# EAGLE design BJ_GIRA_Taster4.4 (EAGLE 7.4.0)
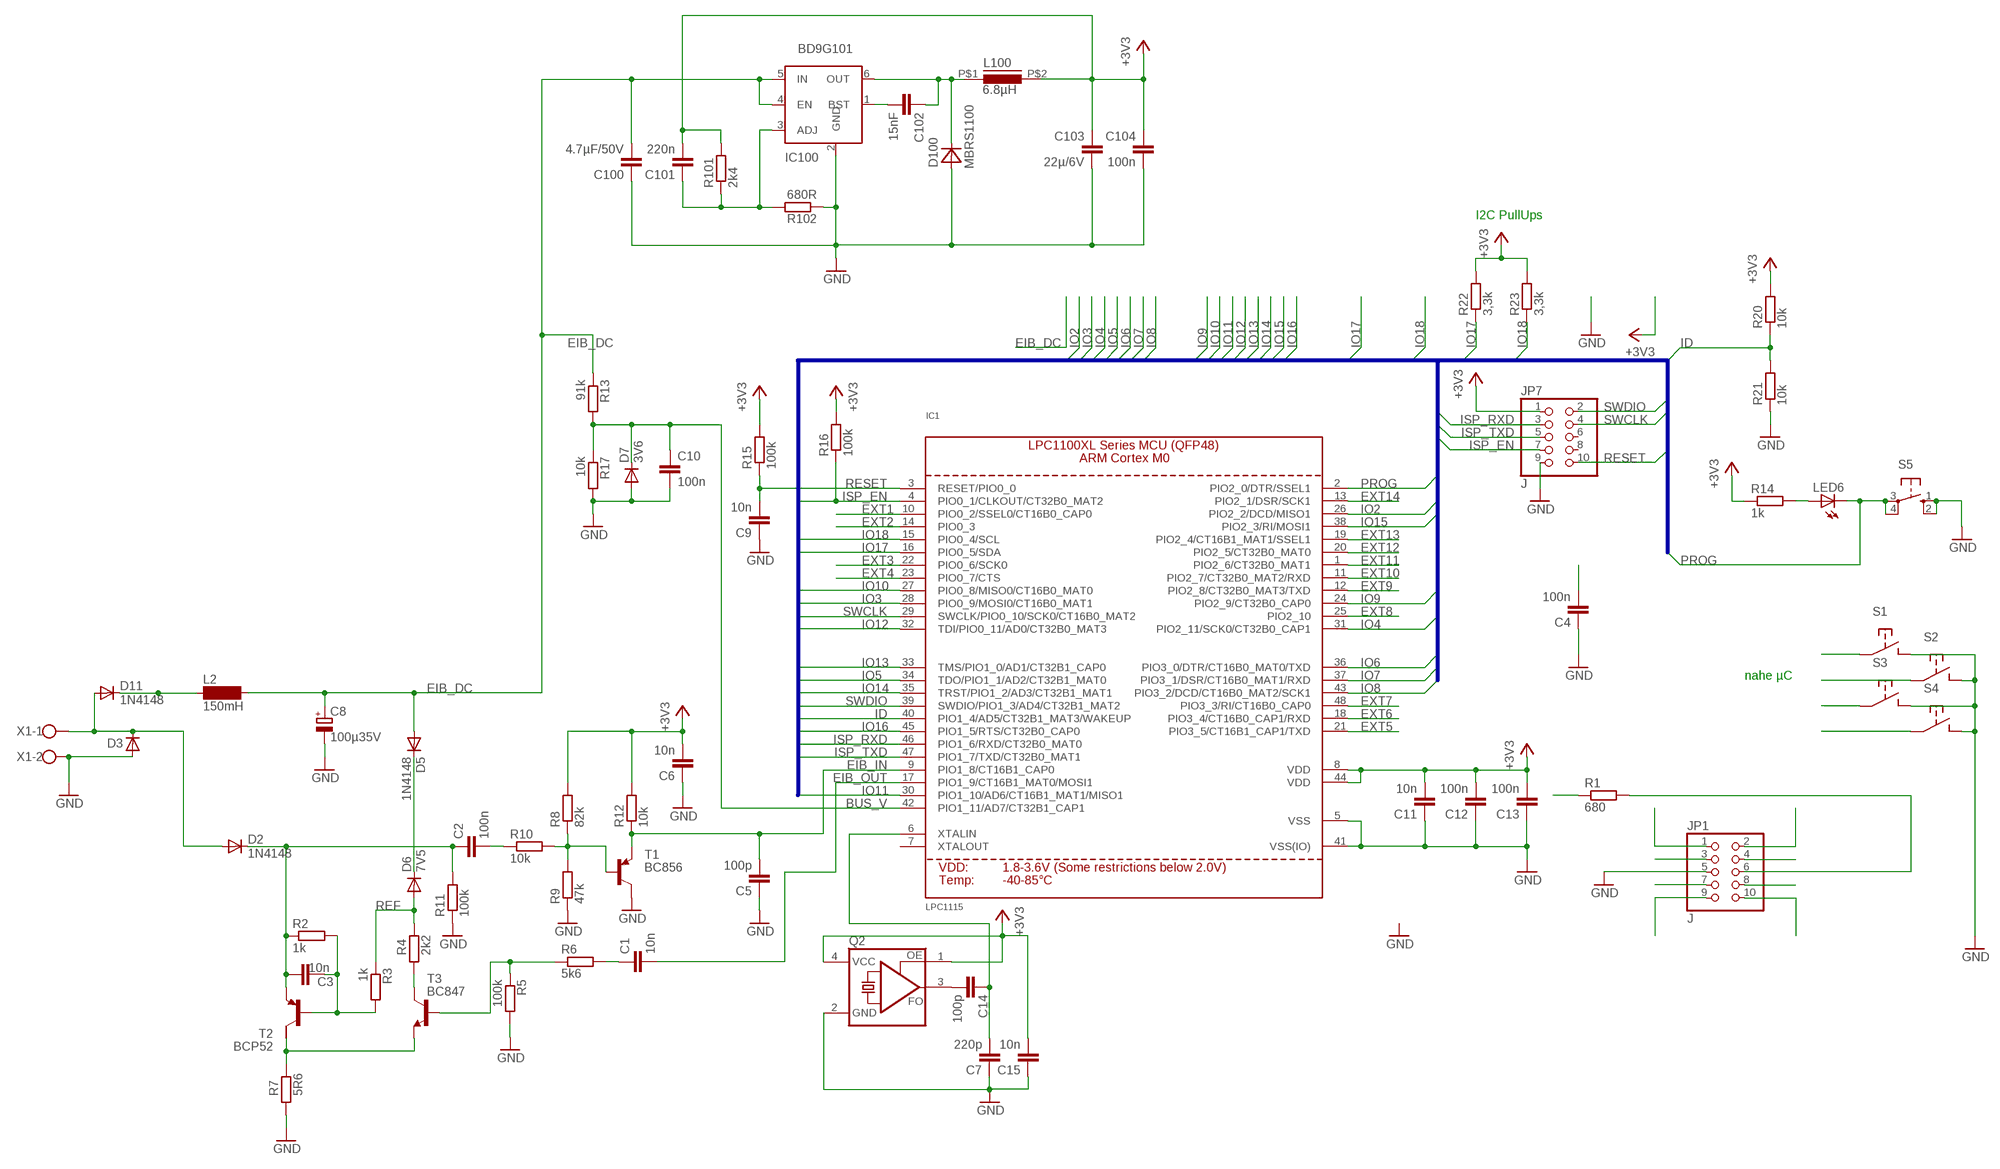
[diagram p0: schematic, sheet 1]

## Parts
C1  10n  C-EUC1206  [C1206]
C2  100n  C-EUC1206  [C1206]
C3  10n  C-EUC1206  [C1206]
C4  100n  C-EUC1206  [C1206]
C5  100p  C-EUC1206  [C1206]
C6  10n  C-EUC1206  [C1206]
C7  220p  C-EUC1206  [C1206]
C8  100µ35V  CPOL-EUE3.5-8  [E3,5-8]
C9  10n  C-EUC1206  [C1206]
C10  100n  C-EUC1206  [C1206]
C11  10n  C-EUC1206  [C1206]
C12  100n  C-EUC1206  [C1206]
C13  100n  C-EUC1206  [C1206]
C14  100p  C-EUC1206  [C1206]
C15  10n  C-EUC1206  [C1206]
C100  4.7µF/50V  C-EUC1206  [C1206]
C101  220n  C-EUC1206  [C1206]
C102  15nF  C-EUC1206  [C1206]
C103  22µ/6V  C-EUC1206  [C1206]
C104  100n  C-EUC1206  [C1206]
D2  1N4148  DIODE-MINIMELF  [MINIMELF]
D3  D-SMB  [SMB]
D5  1N4148  DIODE-MINIMELF  [MINIMELF]
D6  7V5  DIODE-MINIMELF  [MINIMELF]
D7  3V6  DIODE-MINIMELF  [MINIMELF]
D11  1N4148  DIODE-MINIMELF  [MINIMELF]
D100  MBRS1100  MBRA340T3  [SMA]
IC1  LPC1115  LPC1113/4/5_QFP48_XLSERIES  [LQFP48]
IC100  BD9G101  BD9G101GBD9G101G-SOT23-6  [SOT23-6]
JP1  J  PINHD-2X05_2.00  [2X05M]
JP7  J  PINHD-2X05_2.00  [2X05M]
L2  150mH  BS11  [BS11]
L100  6.8µH  IND_FASTRON_1616FPS  [PIS2812]
LED6  LED3MM  [LED3MM]
Q2  ASFL  [ASF]
R1  680  R-EU_R1206  [R1206]
R2  1k  R-EU_R1206  [R1206]
R3  1k  R-EU_R1206  [R1206]
R4  2k2  R-EU_R1206  [R1206]
R5  100k  R-EU_R1206  [R1206]
R6  5k6  R-EU_R1206  [R1206]
R7  5R6  R-EU_R1206  [R1206]
R8  82k  R-EU_R1206  [R1206]
R9  47k  R-EU_R1206  [R1206]
R10  10k  R-EU_R1206  [R1206]
R11  100k  R-EU_R1206  [R1206]
R12  10k  R-EU_R1206  [R1206]
R13  91k  R-EU_R1206  [R1206]
R14  1k  R-EU_R1206  [R1206]
R15  100k  R-EU_R1206  [R1206]
R16  100k  R-EU_R1206  [R1206]
R17  10k  R-EU_R1206  [R1206]
R20  10k  R-EU_R1206  [R1206]
R21  10k  R-EU_R1206  [R1206]
R22  3,3k  R-EU_R1206  [R1206]
R23  3,3k  R-EU_R1206  [R1206]
R101  2k4  R-EU_R1206  [R1206]
R102  680R  R-EU_R1206  [R1206]
S1  33053305A  [3305A]
S2  33053305A  [3305A]
S3  33053305A  [3305A]
S4  33053305A  [3305A]
S5  10-XX  [B3F-10XX]
T1  BC856  BC856BSMD  [SOT23-BEC]
T2  BCP52  FZT753SMD  [SOT223]
T3  BC847  [SOT23]
X1  W237-02P  [W237-132]

## Nets
+3V3: C6.2 C11.2 C12.2 C13.2 C15.2 C101.2 C103.1 C104.1 IC1.8(VDD) IC1.44(VDD) JP1.4 JP7.1 L100.P$2 Q2.1(OE) Q2.4(VCC) R8.2 R12.2 R14.1 R15.2 R16.2 R20.2 R22.2 R23.2 R101.2
BUS_V: C10.2 D7.C IC1.42(PIO1_11/AD7/CT32B1_CAP1) R13.2 R17.1
DRAIN: C2.1 C3.1 D2.C R2.1 R11.2 T2.3(E)
EIB+: D2.A D3.1(C) D11.A X1.1
EIB_DC: C8.+ C100.2 D5.A IC100.4(EN) IC100.5(IN) L2.2 R13.1
EIB_IN: C5.2 IC1.9(PIO1_8/CT16B1_CAP0) R12.1 T1.E
EIB_OUT: C1.2 IC1.17(PIO1_9/CT16B1_MAT0/MOSI1)
EXT1: IC1.10(PIO0_2/SSEL0/CT16B0_CAP0)
EXT2: IC1.14(PIO0_3)
EXT3: IC1.22(PIO0_6/SCK0)
EXT4: IC1.23(PIO0_7/CTS) S2.P$1
EXT5: IC1.21(PIO3_5/CT16B1_CAP1/TXD) JP1.7
EXT6: IC1.18(PIO3_4/CT16B0_CAP1/RXD) JP1.8
EXT7: IC1.48(PIO3_3/RI/CT16B0_CAP0) S1.P$1
EXT8: IC1.25(PIO2_10) S3.P$1
EXT9: IC1.12(PIO2_8/CT32B0_MAT3/TXD)
EXT10: IC1.11(PIO2_7/CT32B0_MAT2/RXD)
EXT11: IC1.1(PIO2_6/CT32B0_MAT1) JP1.10 R1.1
EXT12: IC1.20(PIO2_5/CT32B0_MAT0)
EXT13: IC1.19(PIO2_4/CT16B1_MAT1/SSEL1)
EXT14: IC1.13(PIO2_1/DSR/SCK1) JP1.1
GND: C4.1 C5.1 C6.1 C7.1 C8.- C9.1 C10.1 C11.1 C12.1 C13.1 C15.1 C100.1 C103.2 C104.2 D3.2(A) D7.A D100.A IC1.5(VSS) IC1.41(VSS(IO)) IC100.2(GND) JP1.5 JP7.9 Q2.2(GND) R5.2 R7.1 R9.1 R11.1 R17.2 R21.1 R102.1 S1.P$2 S2.P$2 S3.P$2 S4.P$2 S5.1(S) S5.2(S1) T1.C X1.2
ID: IC1.40(PIO1_4/AD5/CT32B1_MAT3/WAKEUP) R20.1 R21.2
IO2: IC1.26(PIO2_2/DCD/MISO1) JP1.2
IO3: IC1.28(PIO0_9/MOSI0/CT16B0_MAT1)
IO4: IC1.31(PIO2_11/SCK0/CT32B0_CAP1) JP1.3
IO5: IC1.34(TDO/PIO1_1/AD2/CT32B1_MAT0)
IO6: IC1.36(PIO3_0/DTR/CT16B0_MAT0/TXD)
IO7: IC1.37(PIO3_1/DSR/CT16B0_MAT1/RXD)
IO8: IC1.43(PIO3_2/DCD/CT16B0_MAT2/SCK1)
IO9: IC1.24(PIO2_9/CT32B0_CAP0) S4.P$1
IO10: IC1.27(PIO0_8/MISO0/CT16B0_MAT0)
IO11: IC1.30(PIO1_10/AD6/CT16B1_MAT1/MISO1)
IO12: IC1.32(TDI/PIO0_11/AD0/CT32B0_MAT3)
IO13: IC1.33(TMS/PIO1_0/AD1/CT32B1_CAP0)
IO14: IC1.35(TRST/PIO1_2/AD3/CT32B1_MAT1)
IO15: IC1.38(PIO2_3/RI/MOSI1) JP1.9
IO16: IC1.45(PIO1_5/RTS/CT32B0_CAP0)
IO17: IC1.16(PIO0_5/SDA) R22.1
IO18: IC1.15(PIO0_4/SCL) R23.1
ISP_EN: IC1.4(PIO0_1/CLKOUT/CT32B0_MAT2) JP7.7 R16.1
ISP_RXD: IC1.46(PIO1_6/RXD/CT32B0_MAT0) JP7.3
ISP_TXD: IC1.47(PIO1_7/TXD/CT32B0_MAT1) JP7.5
LX: C102.1 D100.C IC100.6(OUT) L100.P$1
N$1: C2.2 R10.1
N$2: C101.1 IC100.3(ADJ) R101.1 R102.2
N$7: R4.1 T3.3(C)
N$8: JP1.6 R1.2
N$9: LED6.A R14.2
N$10: C1.1 R6.2
N$11: C3.2 R2.2 R3.2 T2.1(B)
N$12: R5.1 R6.1 T3.1(B)
N$13: R7.2 T2.2(C) T3.2(E)
N$14: R8.1 R9.2 R10.2 T1.B
N$16: D5.C D6.C
N$17: C7.2 C14.1 IC1.6(XTALIN)
N$18: C14.2 Q2.3(FO)
N$19: C102.2 IC100.1(BST)
N$53: D11.C L2.1
PROG: IC1.2(PIO2_0/DTR/SSEL1) LED6.K(C) S5.3(P) S5.4(P1)
REF: D6.A R3.1 R4.2
RESET: C9.2 IC1.3(RESET/PIO0_0) JP7.10 R15.1
SWCLK: IC1.29(SWCLK/PIO0_10/SCK0/CT16B0_MAT2) JP7.4
SWDIO: IC1.39(SWDIO/PIO1_3/AD4/CT32B1_MAT2) JP7.2
VCC_LPC: C4.2
Unconnected: IC1.7(XTALOUT) JP7.6 JP7.8 T2.4(C/)

## Buses
IO[1..18],RESET,SWCLK,SWDIO,ISP_EN,PROG,ID,ISP_TXD,ISP_RXD

## Notes on the sheet
- I2C PullUps
- nahe µC

## Library data of the parts
C1 C3 C6 C9 C11 = rcl:C-EU: CAPACITOR, European symbol; REICHELT: X7R-G0805 10N
C2 C10 C12 C13 C104 = rcl:C-EU: CAPACITOR, European symbol; REICHELT: X7R-G0805 100N
C4 C7 C14 C15 = rcl:C-EU: CAPACITOR, European symbol
C5 = rcl:C-EU: CAPACITOR, European symbol; REICHELT: NPO-G0805 100P
C8 = rcl:CPOL-EU: POLARIZED CAPACITOR, European symbol
C100 = rcl:C-EU: CAPACITOR, European symbol; REICHELT: X7R-G1206 4,7/50
C101 = rcl:C-EU: CAPACITOR, European symbol; REICHELT: Y5R-G0603 220N
C102 = rcl:C-EU: CAPACITOR, European symbol; REICHELT: X7R-G0805 15N
C103 = rcl:C-EU: CAPACITOR, European symbol; REICHELT: X5R-G0805 22/6
D2 D5 = diode:DIODE-: DIODE; REICHELT: 1N 4148 SMD
D3 = semicon-smd-ipc:D-: DIODE unfilled
D6 = diode:DIODE-: DIODE; REICHELT: SMD ZF 7,5
D7 = diode:DIODE-: DIODE; REICHELT: SMD ZF 3,6
D11 = diode:DIODE-: DIODE
D100 = diode:MBRA340T3: Surface Mount Schottky Power Rectifier Source: http://www.onsemi.com/pub_link/Collateral/MBRA340T3-D.PDF; REICHELT: MBRS 1100 SMD
IC1 = microbuilder:LPC1113/4/5_QFP48_XLSERIES: LPC1113/4/5 ARM Cortex M0 MCU (50MHz) - XL Series (FBD48/3x3) LPC1115FBD48/303: Max Frequency: 50MHz Flash: 64kB SRAM: 8kB ADC: 10-bit
IC100 = Stefan_selfbus:BD9G101G
JP1 JP7 = pinhead-2:PINHD-2X05: PIN HEADER; REICHELT: MPE 150-3-010
L2 = inductor-neosid:BS: INDUCTOR nominal inductance, magnetically screened
L100 = Stefan_selfbus:IND_FASTRON_1616FPS; REICHELT: L-1616FPS 6,8µ
LED6 = led:LED: LED OSRAM: - CHIPLED LG R971, LG N971, LY N971, LG Q971, LY Q971, LO R971, LY R971 LH N974, LH R974 LS Q976, LO Q976, LY Q976 LO Q996 - Hyper CHIPLED LW Q18S LB Q993, LB Q99A, LB R99A - SideLED LS A670, LO A670, LY A670, LG A670, LP A670 LB A673, LV A673, LT A673, LW A673 LH A674 LY A675 LS A676, LA A676, LO A676, LY A676, LW A676 LS A679, LY A679, LG A679 - Hyper Micro SIDELED® LS Y876, LA Y876, LO Y876, LY Y876 LT Y87S - SmartLED LW L88C, LW L88S LB L89C, LB L89S, LG L890 LS L89K, LO L89K, LY L89K LS L896, LA L896, LO L896, LY L896 - TOPLED LS T670, LO T670, LY T670, LG T670, LP T670 LSG T670, LSP T670, LSY T670, LOP T670, LYG T670 LG T671, LOG T671, LSG T671 LB T673, LV T673, LT T673, LW T673 LH T674 LS T676, LA T676, LO T676, LY T676, LB T676, LH T676, LSB T676, LW T676 LB T67C, LV T67C, LT T67C, LS T67K, LO T67K, LY T67K, LW E67C LS E67B, LA E67B, LO E67B, LY E67B, LB E67C, LV E67C, LT E67C LW T67C LS T679, LY T679, LG T679 LS T770, LO T770, LY T770, LG T770, LP T770 LB T773, LV T773, LT T773, LW T773 LH T774 LS E675, LA E675, LY E675, LS T675 LS T776, LA T776, LO T776, LY T776, LB T776 LHGB T686 LT T68C, LB T68C - Hyper Mini TOPLED® LB M676 - Mini TOPLED Santana® LG M470 LS M47K, LO M47K, LY M47K Source: http://www.osram.convergy.de - LUMILED® LXK2-PW12-R00, LXK2-PW12-S00, LXK2-PW14-U00, LXK2-PW14-V00 LXK2-PM12-R00, LXK2-PM12-S00, LXK2-PM14-U00 LXK2-PE12-Q00, LXK2-PE12-R00, LXK2-PE12-S00, LXK2-PE14-T00, LXK2-PE14-U00 LXK2-PB12-K00, LXK2-PB12-L00, LXK2-PB12-M00, LXK2-PB14-N00, LXK2-PB14-P00, LXK2-PB14-Q00 LXK2-PR12-L00, LXK2-PR12-M00, LXK2-PR14-Q00, LXK2-PR14-R00 LXK2-PD12-Q00, LXK2-PD12-R00, LXK2-PD12-S00 LXK2-PH12-R00, LXK2-PH12-S00 LXK2-PL12-P00, LXK2-PL12-Q00, LXK2-PL12-R00 Source: www.luxeon.com
Q2 = crystal:ASF*: CRYSTAL CLOCK OSCILLATORS 5.0 Vdc or 3.3 Vdc - LOW PROFILE ULTRA MINIATURE CERAMIC SURFACE MOUNT Source: http://www.abracon.com/Oscillators/asf1-L-L1.pdf
R1 R14 = rcl:R-EU_: RESISTOR, European symbol
R2 R3 R20 R21 = rcl:R-EU_: RESISTOR, European symbol; REICHELT: SMD-0805 1,00K
R4 = rcl:R-EU_: RESISTOR, European symbol; REICHELT: SMD-0805 2,20K
R5 R11 R15 R16 = rcl:R-EU_: RESISTOR, European symbol; REICHELT: SMD-0805 100K
R6 = rcl:R-EU_: RESISTOR, European symbol; REICHELT: SMD-0805 5,60K
R7 = rcl:R-EU_: RESISTOR, European symbol; REICHELT: SMD-0805 5,60
R8 = rcl:R-EU_: RESISTOR, European symbol; REICHELT: SMD-0805 82,0K
R9 = rcl:R-EU_: RESISTOR, European symbol; REICHELT: SMD-0805 47,0K
R10 R12 R17 = rcl:R-EU_: RESISTOR, European symbol; REICHELT: SMD-0805 10,0K
R13 = rcl:R-EU_: RESISTOR, European symbol; REICHELT: SMD 1/4W 91K
R22 R23 = rcl:R-EU_: RESISTOR, European symbol; REICHELT: SMD-0805 3,30K
R101 = rcl:R-EU_: RESISTOR, European symbol; REICHELT: SMD 1/4W 2,4K
R102 = rcl:R-EU_: RESISTOR, European symbol; REICHELT: SMD-0805 680
S1-S4 = kubi:3305: Taster 3305
S5 = switch-omron:10-XX: OMRON SWITCH
T1 = transistor-pnp:BC856*: PNP Transistror; REICHELT: BC 856B SMD
T2 = transistor-pnp:FZT753SMD: PNP Transistor; REICHELT: BCP 52-16 SMD
T3 = transistor:BC847: NPN TRANSISTOR; REICHELT: BC 847C SMD
X1 = con-wago-508:W237-02P: WAGO SREW CLAMP

## Board
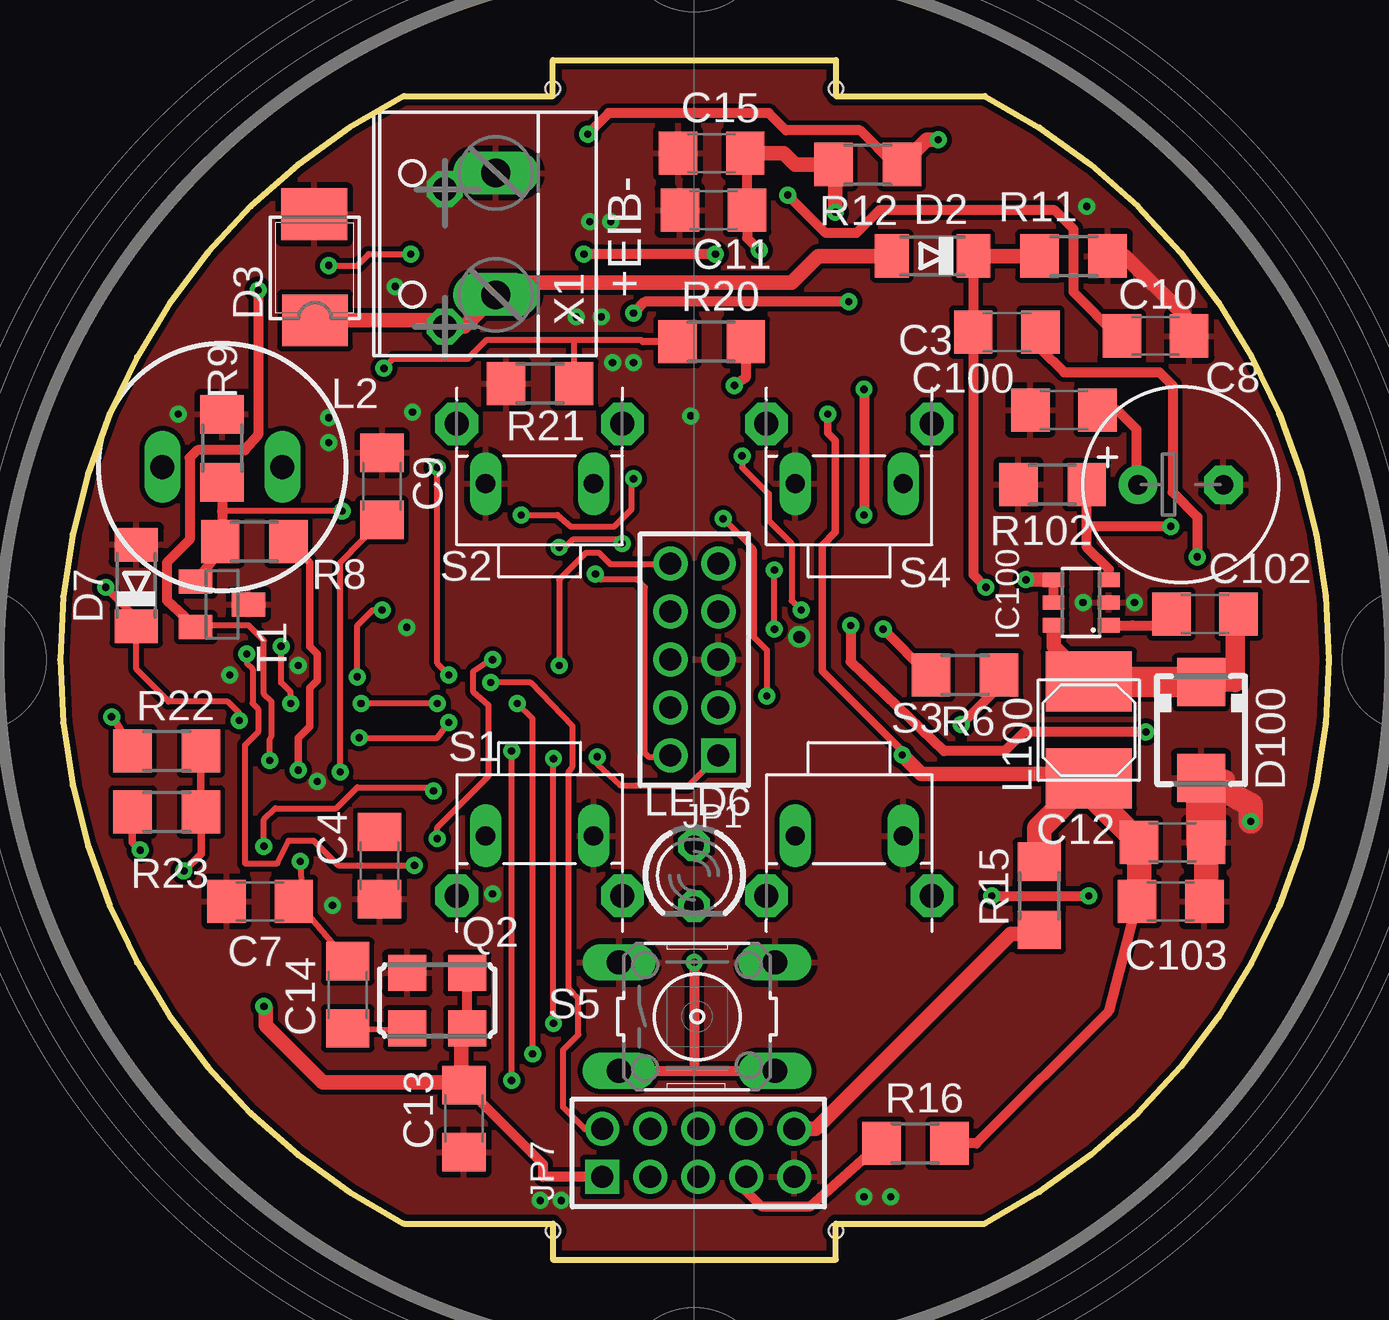
[diagram p1: board, top side]
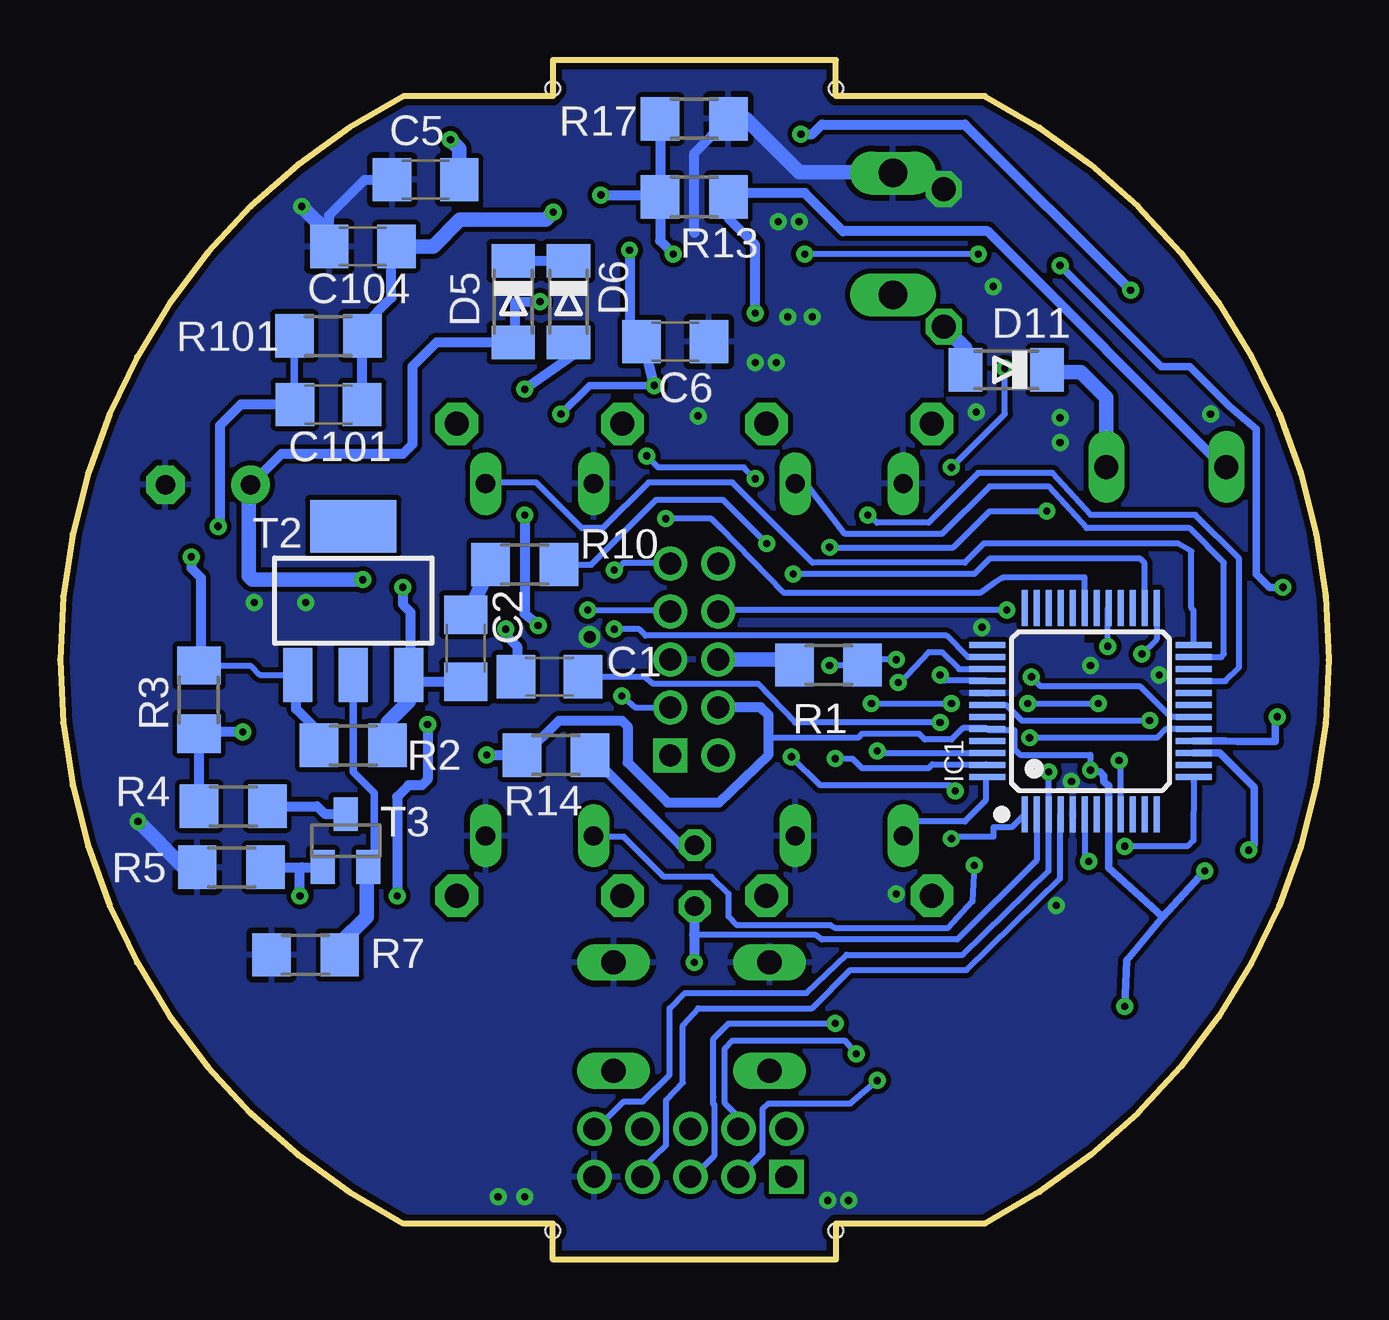
[diagram p2: board, bottom side, seen from below]

Size 52.86 x 50 mm. Coordinates in mm from the lower left corner, seen from the top.
Outline: 20.53,48.5 20.53,50 32.33,50 32.33,48.5 38.53,48.5 arc-126 38.53,1.5 32.33,1.5 32.33,0 20.53,0 20.53,1.5 14.33,1.5 arc-126 14.33,48.5 20.53,48.5
Copper layers (1*16): Top 0.035mm / dielectric 1.5mm / Bottom 0.035mm
Design rules "default *": minimum track width 10mil, minimum drill 0.3mm, track to track 8mil, track to pad 8mil, pad to pad 8mil, via to via 8mil, smd to smd 8mil, copper to edge 10mil, drill to drill 8mil, minimum pad ring 10mil, minimum via ring 8mil, stop-mask expansion 4mil, vias tented up to drill 0.7mm, thermal gap 10mil
Holes 0.6 mm at 20.53,48.8 32.33,48.8 20.54,1.2 32.33,1.2
tKeepout: area 17.2,22.2 to 22.8,27.8; area 3.2,37.4 to 11.1,41.4; area 41.9,37.4 to 49.5,41.4; area 4.1,9.5 to 11.6,13.4; area 41.9,8.6 to 49.5,12.6
bRestrict: area 9.5,25.7 to 10.2,27.4

### Footprints (pad centres in the part's own frame; a part is rotated, then mirrored left to right if it is on the bottom)
C1206 = smd 1.6 x 1.8: 1 -1.4,0; 2 1.4,0
E3,5-8 = drill 0.813 pad 1.6: + -1.778,0 | drill 0.813 pad 1.6 octagon: - 1.778,0
MINIMELF = smd 1.4 x 1.8: A 1.7,0; C -1.7,0
SMB = smd 2.159 x 2.743: 1 -2.311,-0.127; 2 2.108,-0.102
SMA = smd 2 x 2: A 2,0; C -2,0
LQFP48 = smd 1.5 x 0.25: 1 -4.3,2.75; 2 -4.3,2.25; 3 -4.3,1.75; 4 -4.3,1.25; 5 -4.3,0.75; 6 -4.3,0.25; 7 -4.3,-0.25; 8 -4.3,-0.75; 9 -4.3,-1.25; 10 -4.3,-1.75; 11 -4.3,-2.25; 12 -4.3,-2.75; 25 4.3,-2.75; 26 4.3,-2.25; 27 4.3,-1.75; 28 4.3,-1.25; 29 4.3,-0.75; 30 4.3,-0.25; 31 4.3,0.25; 32 4.3,0.75; 33 4.3,1.25; 34 4.3,1.75; 35 4.3,2.25; 36 4.3,2.75 | smd 0.25 x 1.5: 13 -2.75,-4.3; 14 -2.25,-4.3; 15 -1.75,-4.3; 16 -1.25,-4.3; 17 -0.75,-4.3; 18 -0.25,-4.3; 19 0.25,-4.3; 20 0.75,-4.3; 21 1.25,-4.3; 22 1.75,-4.3; 23 2.25,-4.3; 24 2.75,-4.3; 37 2.75,4.3; 38 2.25,4.3; 39 1.75,4.3; 40 1.25,4.3; 41 0.75,4.3; 42 0.25,4.3; 43 -0.25,4.3; 44 -0.75,4.3; 45 -1.25,4.3; 46 -1.75,4.3; 47 -2.25,4.3; 48 -2.75,4.3
SOT23-6 = smd 0.6 x 0.9: 1 -0.95,-1.15; 2 0,-1.15; 3 0.95,-1.15; 4 0.95,1.15; 5 0,1.15; 6 -0.95,1.15
2X05M = drill 0.914 square: 1 -4,-1 | drill 0.914: 2 -4,1; 3 -2,-1; 4 -2,1; 5 0,-1; 6 0,1; 7 2,-1; 8 2,1; 9 4,-1; 10 4,1
BS11 = drill 1 long: 1 -2.5,0; 2 2.5,0
PIS2812 = smd 3.6 x 2.5: P$1 0,2.025; P$2 0,-2.025
LED3MM = drill 0.813 octagon: A -1.27,0; K 1.27,0
ASF = smd 1.6 x 1.5: 1 -1.25,-1.15; 2 1.25,-1.15; 3 1.25,1.15; 4 -1.25,1.15
R1206 = smd 1.6 x 1.803: 1 -1.422,0; 2 1.422,0
3305A = drill 0.8 long: P$1 -2.25,0; P$2 2.25,0 | drill 1 pad 1.778 octagon: P$3 -3.45,-2.5; P$4 3.45,-2.5
B3F-10XX = drill 1.016 long: 1 -3.251,2.261; 2 3.251,2.261; 3 -3.251,-2.261; 4 3.251,-2.261
SOT23-BEC = smd 1 x 1.4: B -0.95,-1.1; C 0,1.1; E 0.95,-1.1
SOT223 = smd 1.219 x 2.235: 1 -2.311,-3.099; 2 0,-3.099; 3 2.311,-3.099 | smd 3.6 x 2.2: 4 0,3.099
SOT23 = smd 1 x 1.4: 1 -0.95,-1.1; 2 0.95,-1.1; 3 0,1.1
W237-132 = drill 1.194 long: 1 -2.54,-0.635; 2 2.54,-0.635

### Placement (x,y rotation side)
C1  32.47,24.29 0 bottom
C2  35.96,25.48 90 bottom
C3  39.45,38.66 0 top
C4  13.31,16.42 90 top
C5  37.63,45.01 0 bottom
C6  27.23,38.26 180 bottom
C7  8.34,14.92 0 top
C8  46.7,32.3 0 top
C9  13.42,32.23 270 top
C10  45.64,38.5 180 top
C11  27.23,43.74 0 top
C12  46.36,17.38 180 top
C13  16.83,5.87 90 top
C14  11.99,11.03 270 top
C15  27.15,46.12 0 top
C100  41.83,35.4 0 top
C101  41.68,35.64 0 bottom
C102  47.71,26.91 180 top
C103  46.28,14.92 0 top
C104  40.25,42.23 180 bottom
D2  36.36,41.83 180 top
D3  10.49,41.46 90 top
D5  33.98,39.93 270 bottom
D6  31.67,39.93 270 bottom
D7  3.18,28.1 90 top
D11  13.44,37.08 180 bottom
D100  47.55,22.07 270 top
IC1  9.93,22.86 90 bottom
IC100  42.55,27.38 90 top
JP1  26.44,25 90 top
JP7  26.59,4.45 0 top
L2  6.76,33.04 180 top
L100  42.87,22.07 0 top
LED6  26.42,16 270 top
Q2  15.72,10.8 180 top
R1  20.85,24.78 180 bottom
R2  40.64,21.43 180 bottom
R3  47.07,23.34 90 bottom
R4  45.64,18.89 180 bottom
R5  45.72,16.35 180 bottom
R6  37.71,24.37 180 top
R7  42.63,12.7 0 bottom
R8  8.1,29.92 0 top
R9  6.75,33.81 270 top
R10  33.5,28.97 0 bottom
R11  42.23,41.83 180 top
R12  33.66,45.64 180 top
R13  26.44,44.29 180 bottom
R14  32.2,21.02 0 bottom
R15  40.8,15.16 90 top
R16  35.64,4.84 0 top
R17  26.44,47.55 0 bottom
R20  27.15,38.26 0 top
R21  20.01,36.51 0 top
R22  4.45,21.19 0 top
R23  4.45,18.65 0 top
R101  41.68,38.5 0 bottom
R102  41.36,32.31 0 top
S1  19.98,17.66 0 top
S2  19.98,32.34 180 top
S3  32.88,17.66 0 top
S4  32.88,32.34 180 top
S5  26.55,10.12 0 top
T1  6.75,27.31 270 top
T2  40.64,27.46 0 bottom
T3  40.96,17.46 0 bottom
X1  17.52,42.75 90 top

### Tracks (layer width: path | path; a pad name or v marks a point on that pad's centre or on a via)
+3V3  (via drill 0.3)
  Top 0.305: R22.2 R23.2 5.88,16.91 v5.16,16.19 | 8.58,10.48 v8.5,10.56 | v31.99,35.24 31.99,34.45 32.31,34.13 32.31,30.32 31.75,29.77 31.75,24.53 35.09,21.19 v35.09,21.04 | R8.2 10.4,29.05 10.4,25.56 10.72,25.24 10.72,24.13 10.4,23.81 10.4,22.23 9.93,21.75 v9.93,20.4
  Top 0.406: C103.1 43.69,10.35 38.18,4.84 R16.2 | R15.2 40.8,17.07 | Q2.1 Q2.4 17.47,9.19 | JP7.1 20.13,3.45 20.13,3.97 C13.2 | R20.2 28.57,36.76 v28.1,36.43 | C15.2 28.63,46.04 C11.2 28.63,42.57 v29.14,42.07
  Top 0.61: C15.2 30.17,46.12 30.64,45.64 R12.2 32.31,45.57 v32.31,43.66 | v35.09,21.04 35.88,20.24 42.67,20.24 L100.P$2 | 8.58,10.48 8.58,9.76 10.96,7.38 16.72,7.38 | 16.72,7.38 C13.2 | 16.72,7.38 16.72,9.4 Q2.4
  Top 1.016: 40.8,17.07 40.8,17.98 L100.P$2 42.87,19.48 C12.2 44.96,15 C103.1
  Bottom 0.254: v9.93,20.4 9.93,21.04 12.86,21.04 13.1,21.27 13.1,22.07 14.18,22.07 IC1.44 14.26,22.15 15.24,22.15 15.72,21.67 16.83,21.67 17.07,21.91 19.45,21.91 19.61,21.75 23.34,21.75
  Bottom 0.305: v8.5,10.56 8.42,12.46 6.91,14.29 | 6.91,14.29 v5.16,16.19 | 6.91,14.29 9.18,16.32 IC1.8 9.18,19.73 9.37,19.92 9.37,20.16 9.53,20.32 v9.93,20.4 | v28.1,36.43 30.8,36.43 v31.99,35.24
  Bottom 0.406: C101.2 40.28,38.48 R101.2 40.25,38.89 39.06,40.09 39.06,42.02 C104.1 | v35.09,21.04 33.63,21.04 R14.1 33.51,21.02 32.07,22.46 29.45,22.46 29.21,22.23 29.21,20.72 27.55,19.05 25.4,19.05 23.34,21.04 23.34,21.75 23.34,22.7 23.66,23.02 25.42,23.02 JP1.4 | v28.1,36.43 28.58,38.37 C6.2 29.14,38.76 v29.14,42.07
  Bottom 0.61: C104.1 37.31,42.23 36.2,43.34 32.63,43.34 v32.31,43.66
BUS_V  (via drill 0.3)
  Top 0.254: v7.47,22.46 7.47,22.78 6.99,23.26 4.53,23.26 3.18,24.61 D7.C | v11.2,41.43 12.39,41.43 12.86,41.91 v14.61,41.91
  Top 0.305: v1.91,28.02 3.18,26.75 D7.C
  Top 0.406: C10.2 44.06,38.5 42.23,40.32 42.23,42.94 41.44,43.74 34.14,43.74 33.18,42.78 31.91,42.78 v30.33,44.37 | v27.31,41.91 v21.83,41.91
  Bottom 0.254: IC1.42 13.43,23.11 12.78,22.46 v7.47,22.46 | v14.61,41.91 v21.83,41.91
  Bottom 0.305: v11.2,41.43 6.99,37.23 5.8,37.23 4.13,35.56 3.02,34.61 3.02,28.58 2.46,28.02 v1.91,28.02
  Bottom 0.406: R17.1 R13.2 | v30.33,44.37 27.94,44.37 R13.2 | R13.2 27.86,42.46 v27.31,41.91
DRAIN  (via drill 0.3)
  Top 0.406: D2.C C3.1 | C3.1 | C3.1 38.06,28.54 v38.58,28.02
  Top 0.61: R11.2 D2.C
  Bottom 0.406: C2.1 38.05,24.08 T2.3 38.26,24.43 38.26,26.99 38.58,27.31 v38.58,28.02
  Bottom 0.61: T2.3 38.33,23.27 39.22,22.38 R2.1
EIB+  (via drill 1)
  Top 0.61: D2.A 31.6,41.83 30.48,40.72 18.67,40.72 X1.1 16.84,38.89 v16.04,38.89 15.78,39.15 D3.1
  Bottom 0.61: D11.A 15.14,37.99 v16.04,38.89
EIB_DC  (via drill 0.3)
  Top 0.406: IC100.5 IC100.4 | C100.2 44.06,35.4 44.85,34.61 44.85,32.37 C8.+ | v32.87,39.93 24.37,39.93 v23.9,39.45
  Top 0.61: IC100.4 v40.25,28.34
  Bottom 0.406: L2.2 4.39,33.04 14.21,42.86 20.24,42.86 21.83,44.45 24.86,44.45 R13.1 25.01,43.41 23.9,42.29 v23.9,39.45 | C8.+ 43.64,33.58 38.58,33.58 38.18,33.97 38.18,37.23 37.18,38.23 D5.A 33.9,38.31 33.9,39.93 v32.87,39.93
  Bottom 0.61: v40.25,28.34 44.85,28.34 45.01,28.5 45.01,32.21 C8.+
EIB_IN  (via drill 0.3)
  Top 0.254: v8.74,20.8 8.74,21.67 8.82,21.83 8.82,23.26 8.5,23.57 8.5,25.8 7.86,26.43 5.49,26.43 T1.E
  Top 0.406: R12.1 34.77,45.64 33.34,47.07 30.25,47.07 29.53,47.78 22.86,47.78 v21.99,46.91 | v8.26,40.4 8.26,34.37 7.7,33.73 5.72,33.73 5.4,33.42 5.4,30 4.45,29.05 4.45,27.48 T1.E
  Top 0.61: v36.6,46.67 36.11,46.67 R12.1
  Bottom 0.254: IC1.9 8.68,20.7 v8.74,20.8
  Bottom 0.406: v21.99,46.91 21.51,46.91 21.12,47.31 15.17,47.31 v8.26,40.4
  Bottom 0.61: C5.2 36.23,46.3 v36.6,46.67
EIB_OUT  (via drill 0.3)
  Top 0.254: v12.47,21.75 15.72,21.75 v16.2,22.38
  Bottom 0.254: IC1.17 6.79,22.11 7.15,21.75 v12.47,21.75 | v16.2,22.38 22.23,22.38 23.78,24 28.14,24 28.5,24.29 C1.2
EXT4
  Bottom 0.254: IC1.23 4.48,25.11 4.37,25.24 4.37,29.05 5.8,30.48 10.08,30.48 11.67,32.23 14.13,32.23 16.12,30.24 20.17,30.24 21.75,32.31 22.2,32.31 S2.P$1
EXT5  (via drill 0.3)
  Top 0.254: v19.21,31.04 20.72,31.04 21.28,30.56 23.1,30.56 23.82,31.27 23.82,32.31 v23.9,32.54 | v28.42,33.5 28.42,33.02 29.53,31.91 29.53,30.8 30.48,29.85 30.48,27.46 v30.88,27.07
  Bottom 0.254: IC1.21 4.31,24.11 3.74,24.69 3.74,29.21 5.56,31.04 9.93,31.04 11.51,32.78 14.61,32.78 16.67,30.72 18.82,30.72 v19.21,31.04 | v23.9,32.54 24.37,33.02 27.94,33.02 v28.42,33.5 | v30.88,27.07 27.5,27.07 JP1.7
EXT6  (via drill 0.3)
  Top 0.254: v12.39,24.29 12.39,26.43 13.02,27.07 v13.42,27.07
  Bottom 0.254: IC1.18 6.58,22.61 7.86,23.89 11.99,23.89 v12.39,24.29 | v13.42,27.07 25.37,27.07 JP1.8
EXT7
  Bottom 0.254: IC1.48 14.29,20.05 14.29,19.13 15.17,18.26 17.78,18.26 17.73,18.2 S1.P$1
EXT8  (via drill 0.3)
  Top 0.254: v7.78,25.24 7.78,24.84 8.02,24.61 8.02,23.18 8.26,22.94 8.26,21.99 7.7,21.43 7.7,16.51 9.05,16.51 9.53,17.46 10.56,17.46 11.59,16.43 v14.77,16.43 14.93,16.43
  Bottom 0.254: IC1.25 7.18,25.85 v7.78,25.24 | v14.77,16.43 14.85,14.92 15.88,13.81 20.56,13.81 20.77,13.94 24.66,13.94 25.01,14.29 25.01,15.24 25.72,15.95 27.71,15.95 29.37,17.62 30.59,17.62 S3.P$1
EXT11  (via drill 0.3)
  Top 0.254: v15.72,17.54 15.72,18.02 17.86,20.16 17.86,23.1 17.23,23.65 17.23,24.53 17.94,25 v18.02,25 | JP1.10 25.41,28.97 22.94,28.97 22.47,29.45 21.91,29.45 20.8,28.34 v20.8,24.77
  Bottom 0.254: IC1.1 13.22,18.02 13.97,18.02 13.97,17.62 15.8,17.62 v15.72,17.54 | v18.02,25 18.82,25 19.42,25.03 R1.1 20.87,24.78 v20.8,24.77
EXT14  (via drill 0.3)
  Top 0.254: v8.5,17.23 8.5,18.34 8.97,18.81 11.51,18.81 12.39,19.69 15.4,19.69 v15.56,19.53 | v22.39,20.96 22.39,20.64 23.34,19.77 26.2,19.77 JP1.1
  Bottom 0.254: IC1.13 5.63,19.91 5.64,17.46 5.88,17.23 v8.5,17.23 | v15.56,19.53 15.8,19.77 21.2,19.77 v22.39,20.96
GND  (via drill 0.3, 0.5, 1)
  Top 0.61: R11.1 44.38,41.83 46.84,39.37 46.84,38.71 C10.1
  Top 0.813: 48.55,20.02 D100.A
  Top 1.016: v49.61,18.26 49.61,18.96 D100.A | C12.1 47.76,15 C103.2
  Top 1.676: C12.1 47.76,19.32 D100.A
  Bottom 0.406: 26.44,42.78 26.44,46.12 R17.2 | C104.2 41.65,43.53 40.17,45.01 C5.1
  Bottom 0.61: R17.2 24.29,47.55 22.07,45.32 18.19,45.32 X1.2 | C104.2 41.65,42.76 v42.79,43.9 | R5.2 47.71,16.35 v49.61,18.26
  other vias: 30.8,25.96 9.93,24.77 14.45,26.35 10.72,19.92 11.35,14.76 11.2,34.05 13.97,40.56 4.93,35.24 11.2,35.08 14.69,35.32 18.02,15.24 7.07,24.37 33.5,2.62 34.61,2.62 20.01,2.46 20.88,2.46 26.28,35.16 16.04,44.61 23.02,37.39 23.9,37.39 22.55,39.29 21.51,39.29 22.07,43.26 22.94,43.26 42.63,27.38 44.77,27.38
  pour Top: -1.35,51.99 55.8,51.99 55.8,-2.22 -1.35,-2.22 -1.35,-1.43
  pour Bottom: -1.66,25.56 -0.63,25.56 -0.63,51.12 54.85,51.12 54.85,-2.14 -1.27,-2.14 -1.27,9.76
ID  (via drill 0.3)
  Top 0.254: v16.2,24.37 15.72,24.84 v15.72,33.02 | v13.5,37.15 13.89,37.55 16.99,37.55 17.78,38.34 21.36,38.34 | 21.36,38.34 24.21,38.34 24.29,38.26 | R21.2 21.43,38.27 21.36,38.34
  Top 0.3: R20.1 24.29,38.26
  Bottom 0.254: IC1.40 14.25,24.13 16.04,24.13 16.2,24.29 v16.2,24.37 | v15.72,33.02 13.5,35.24 v13.5,37.15
IO2  (via drill 0.3)
  Top 0.254: JP1.2 25.39,20.96 24.53,20.96 24.37,21.11 24.37,28.02 24.05,28.34 22.55,28.34 v22.31,28.58
  Bottom 0.254: IC1.26 7.68,29.02 7.86,29.21 14.13,29.21 14.77,28.58 v22.31,28.58
IO4  (via drill 0.3)
  Top 0.254: v27.63,30.88 28.9,29.61 28.9,25.96 29.45,25.4 v29.45,23.5
  Bottom 0.254: IC1.31 10.18,28.43 13.58,28.42 13.97,28.18 14.53,27.78 22.71,27.78 25.32,30.48 25.72,30.88 v27.63,30.88 | v29.45,23.5 28.9,23.02 27.45,23.02 JP1.3
IO9
  Bottom 0.254: IC1.24 5.63,27.05 5.72,27.15 5.72,29.53 6.27,29.85 14.37,29.85 15.17,29.05 21.51,29.05 24.85,32.39 28.34,32.39 30.25,30.48 31.12,30.48 33.02,32.39 35.09,32.39 S4.P$1
IO15  (via drill 0.3)
  Top 0.254: v29.77,26.27 v29.77,28.73
  Bottom 0.254: IC1.38 15.03,25.11 15.92,26 28.47,26 28.74,26.27 v29.77,26.27 | v29.77,28.73 29.69,28.73 29.37,29.05 27.48,29.05 JP1.9
IO17  (via drill 0.3 pad 0.25)
  Top 0.305: v2.15,22.62 2.31,22.46 R22.1
  Bottom 0.305: IC1.16 4.31,21.61 3.81,21.59 2.23,21.59 2.23,22.3 | 2.15,22.38 2.23,22.3 | 2.23,22.3 v2.15,22.62
IO18  (via drill 0.3 pad 0.25)
  Top 0.305: v3.34,17.07 3.02,17.38 R23.1
  Bottom 0.305: IC1.15 4.53,21.11 3.11,19.69 3.11,17.31 v3.34,17.07
ISP_EN
  Top 0.406: JP7.7 28.6,2.84 29.21,2.22 31.28,2.22 R16.1
  Bottom 0.254: JP7.7 28.6,3.79 27.61,4.76 27.61,6.65 26.91,7.38 26.91,9.76 26.28,10.48 21.51,10.48 19.93,12.07 15.09,12.07 11.2,15.88 11.2,18.54 IC1.4
ISP_RXD  (via drill 0.3 pad 0.25)
  Top 0.254: v18.82,7.46 v18.82,21.19
  Bottom 0.254: JP7.3 24.58,3.45 23.59,4.45 23.59,6.27 23.34,6.51 19.93,6.51 v18.82,7.46 | v18.82,21.19 18.5,21.11 14.3,21.11 IC1.46
ISP_TXD  (via drill 0.3 pad 0.25)
  Top 0.254: v20.56,9.84 v20.56,20.88
  Bottom 0.254: JP7.5 26.48,3.45 25.61,4.32 25.59,4.36 25.59,6.46 25.64,6.46 25.64,6.77 25.64,9.21 25.01,9.84 v20.56,9.84 | v20.56,20.88 19.85,20.88 19.45,20.48 16.67,20.48 16.51,20.64 14.28,20.64 IC1.47
LX
  Top 0.61: 42.89,24.07 L100.P$1 41.4,25.56 IC100.6
  Top 0.813: D100.C 48.84,24.07 48.98,24.92 48.98,26.06 | 48.98,26.06 48.98,26.94 C102.1 | 48.98,24.05 48.98,26.06
  Top 1.27: D100.C 42.89,24.07
N$1
  Bottom 0.61: R10.1 35.77,27.07 C2.2
N$2  (via drill 0.3)
  Top 0.406: IC100.3 43.7,28.77 42.79,29.69 42.79,30.56 | 42.79,30.56 R102.2 | v46.28,30.56 42.79,30.56
  Bottom 0.305: R101.1 43.1,35.66 C101.1
  Bottom 0.406: C101.1 45.33,35.64 46.2,34.77 46.2,30.64 v46.28,30.56
N$7
  Bottom 0.406: R4.1 42.15,18.89 41.84,18.57 40.97,18.57 T3.3
N$8
  Bottom 0.61: JP1.6 22.44,25 R1.2
N$9
  Bottom 0.406: LED6.A 27.02,17.27 R14.2
N$10  (via drill 0.3)
  Top 0.406: R6.2 36.2,24.37 v34.29,26.27
  Bottom 0.406: v34.29,26.27 34.29,26.04 33.82,25.56 33.82,24.34 C1.1
N$11  (via drill 0.3)
  Top 0.406: C3.2 40.85,37.97 41.84,36.99 45.8,36.99 46.36,36.43 46.36,31.99 47.39,30.96 v47.39,29.29
  Bottom 0.254: R3.2 44.92,24.76 44.53,24.37 T2.1
  Bottom 0.406: R2.2 42.07,21.98 43.03,22.94 43.03,24.3 T2.1 | v47.39,29.29 47.39,28.81 46.99,28.42 46.99,24.84 R3.2
N$12  (via drill 0.3)
  Top 0.406: R6.1 39.13,23.89 v37.55,22.3 | v38.82,15.16 v42.87,15.16
  Bottom 0.406: R5.1 42.79,16.35 | 42.79,16.35 T3.1 | v37.55,22.3 37.55,20 37.79,19.77 38.34,19.77 38.82,19.29 v38.82,15.16 | v42.87,15.16 42.87,16.27 42.79,16.35
N$13
  Bottom 0.254: 39.77,16.37 T3.2
  Bottom 0.305: T2.2 40.64,20.32 39.77,19.45 39.77,16.37
  Bottom 0.61: R7.2 41.21,13.17 40.09,14.29 40.09,16.29 T3.2
N$14  (via drill 0.3)
  Top 0.254: v23.42,29.85 23.26,30 21.36,30 21.04,29.69 v20.8,29.69 | v11.75,31.2 6.75,31.2
  Top 0.406: R9.2 6.75,31.2 6.75,30.4 R8.1 6.52,29.36 T1.B
  Bottom 0.254: R10.2 30.73,28.97 28.02,31.67 25.25,31.67 v23.42,29.85 | v20.8,29.69 15.64,29.69 14.13,31.2 v11.75,31.2
N$16
  Bottom 0.406: D5.C D6.C 31.2,41.63
N$17  (via drill 0.3 pad 0.25)
  Top 0.254: v10.01,16.59 10.08,14.89 C7.2 10.14,14.61 C14.1
  Bottom 0.254: IC1.6 10.18,16.76 v10.01,16.59
N$18
  Top 0.254: C14.2 14.72,9.55 Q2.3
N$19
  Top 0.406: IC100.1 44.7,26.43 45.88,26.43 46.39,27.23 C102.2
N$53
  Bottom 0.61: L2.1 9.26,35.93 10.32,36.99 11.64,36.99 D11.C
PROG  (via drill 0.3 pad 0.25)
  Top 0.406: S5.3 26.36,7.86 | 26.36,7.86 S5.4 | v26.44,12.38 26.44,7.94 26.36,7.86
  Bottom 0.254: IC1.2 12.18,16.64 15.48,13.34 21.12,13.34 21.38,13.53 26.44,13.54
  Bottom 0.406: v26.44,12.38 26.44,13.54 26.44,14.71 LED6.K
REF  (via drill 0.3)
  Top 0.406: v33.5,36.27 v33.5,31.04 33.5,30.96 | v32.95,26.43 32.95,24.92 36.83,21.19 39.37,21.19 40.17,21.99 v45.25,21.99
  Bottom 0.406: R4.2 R3.1 47,21.99 v45.25,21.99 | D6.A 31.12,37.94 v33.5,36.27 | v33.5,31.04 33.5,26.91 32.87,26.43 v32.95,26.43
RESET  (via drill 0.3)
  Top 0.254: v11.67,20.32 11.67,29.05 12.15,29.53 12.15,29.56 C9.2
  Top 0.61: JP7.10 31.48,5.45 39.61,13.57 40.64,13.57 R15.1
  Bottom 0.254: JP7.10 30.52,5.45 29.37,6.59 28.58,6.59 27.47,7.7 27.47,10.48 26.83,11.11 21.75,11.11 20.09,12.7 15.24,12.7 11.67,16.19 IC1.3 v11.68,20.32 v11.67,20.32
SWCLK  (via drill 0.3, 0.3 pad 0.25)
  Top 0.254: v19.69,8.57 19.69,22.54 v19.05,23.18 | v9.61,23.18 9.61,23.65 9.21,24.05 v9.21,25.56 | v15.72,23.18 v12.55,23.18
  Bottom 0.254: JP7.4 24.6,5.94 25.17,6.51 25.17,8.81 24.85,9.13 20.17,9.13 v19.69,8.57 | v9.21,25.56 9.21,27.12 IC1.29 | v19.05,23.18 v15.72,23.18 | v12.55,23.18 v9.61,23.18
SWDIO  (via drill 0.3 pad 0.25)
  Top 0.254: JP7.2 21.86,5.45 20.96,6.35 20.96,8.73 21.59,9.37 21.59,10.88 21.2,11.27 21.2,20.32 21.36,20.56 21.36,22.23 19.61,24.05 v17.94,24.05
  Bottom 0.254: v17.94,24.05 17.86,24.05 16.67,25.32 16.12,25.32 15.4,24.61 IC1.39

### Text on the board
tPlace: +EIB- | BJ_Taster5.0
Mechanik: Material Edelstahl 0,8mm | Einheit ist mm Aussenmasse (70.8x70.8)